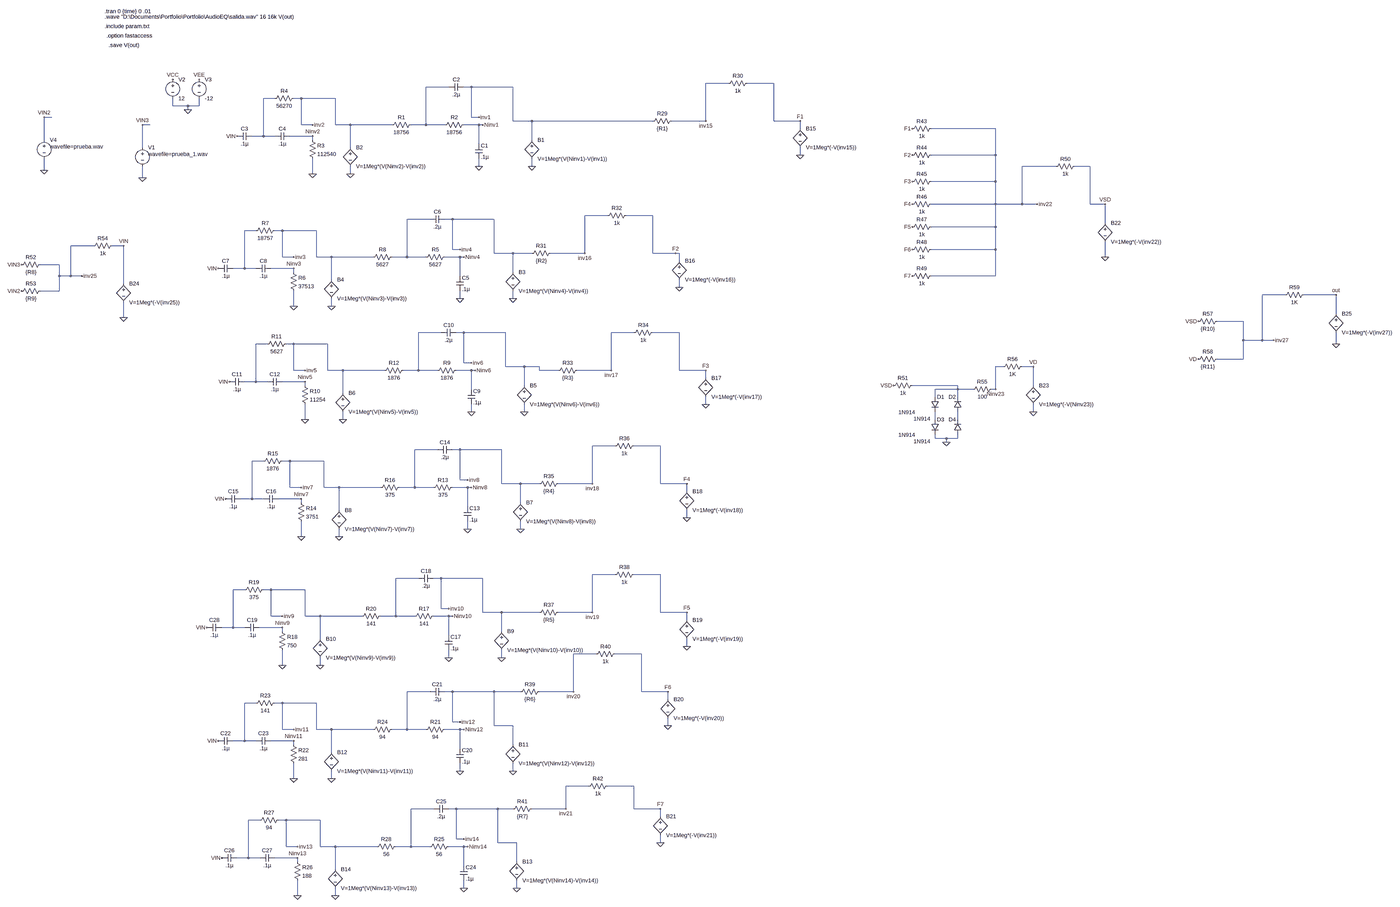
[diagram p0: schematic Test.asc, whole sheet]
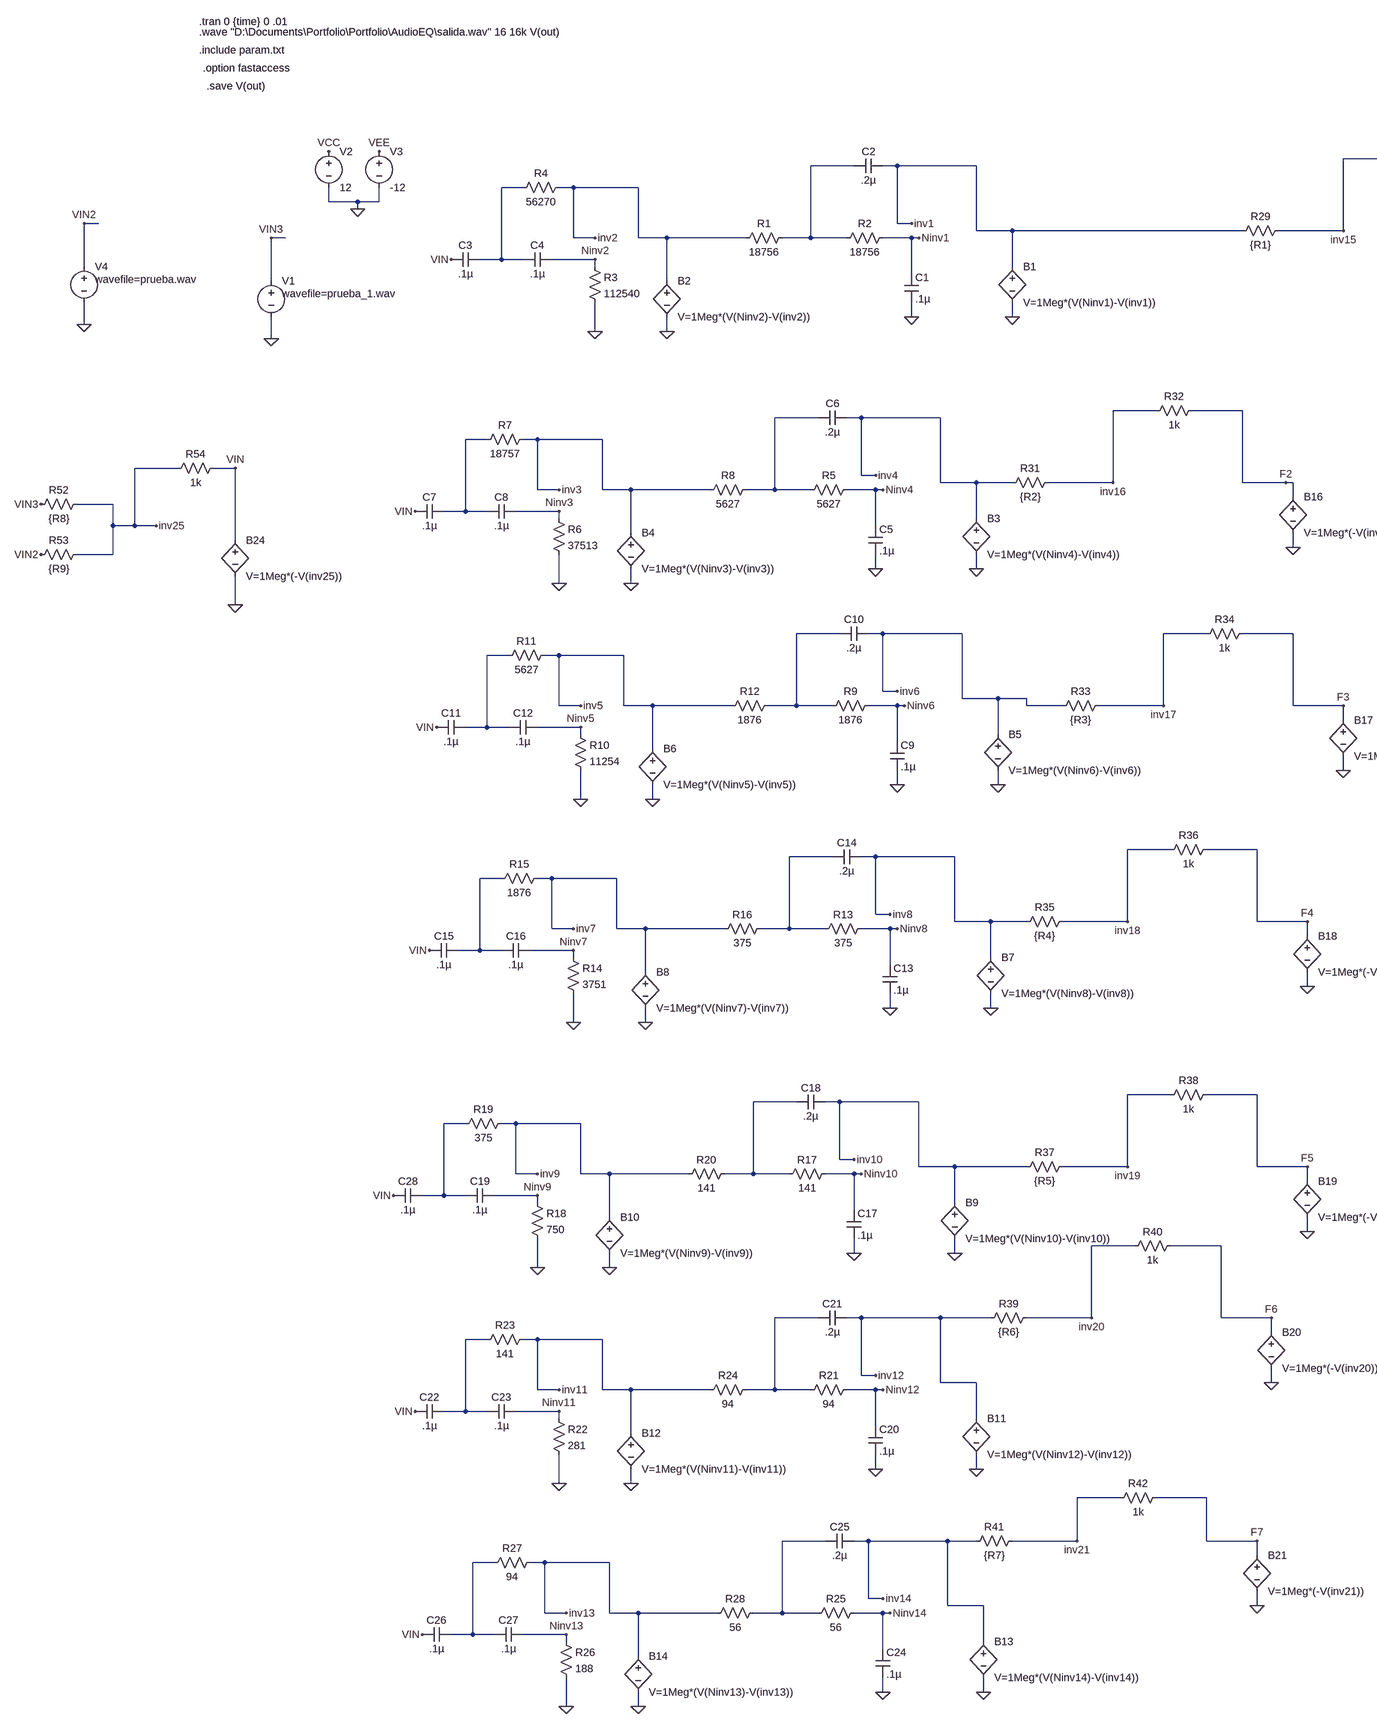
[diagram p1: schematic Test.asc, part, row 1 of 1, column 1 of 2]
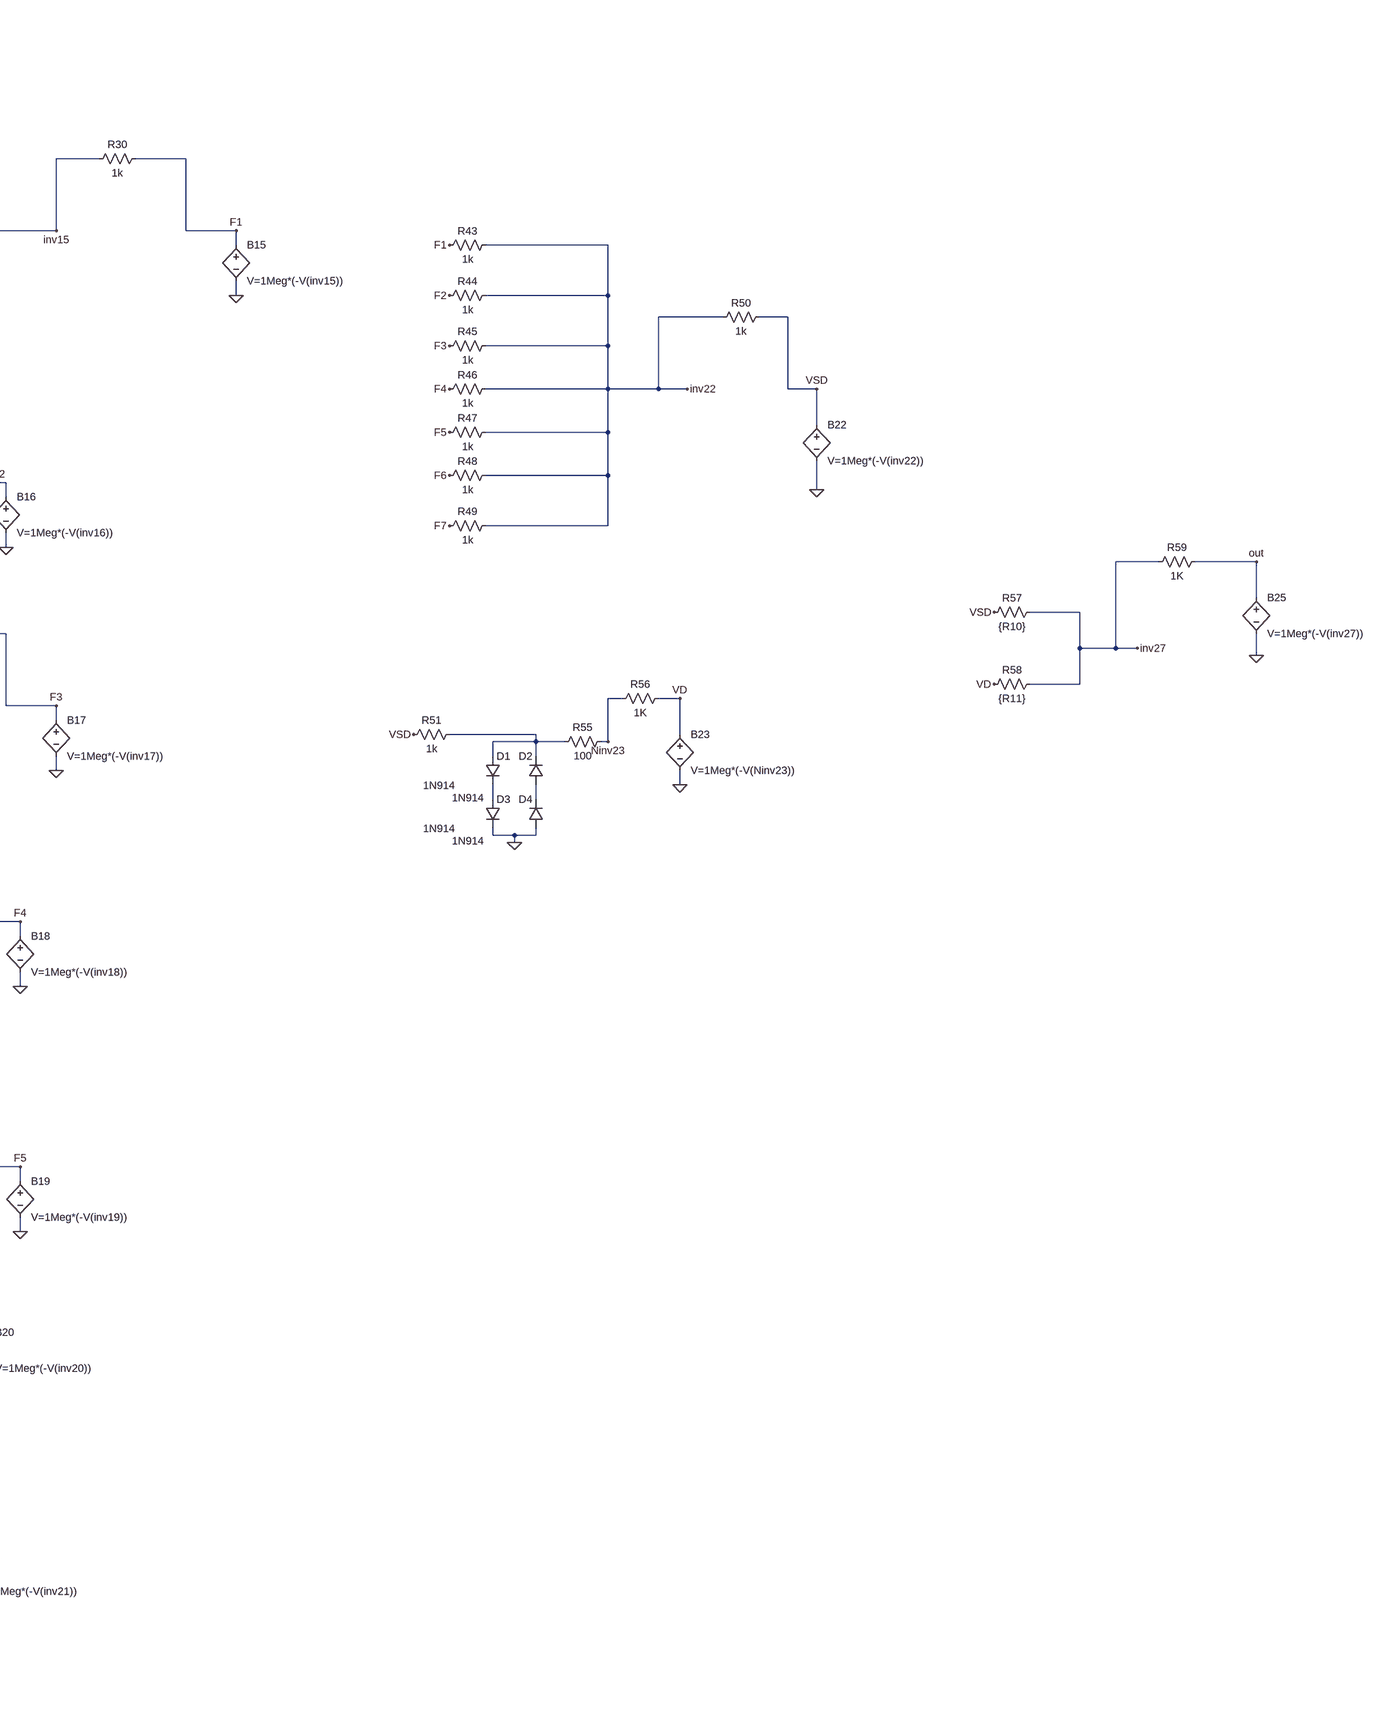
[diagram p2: schematic Test.asc, part, row 1 of 1, column 2 of 2]
Test.asc, the LTspice schematic file:
Version 4
SHEET 1 5436 3400
WIRE 2224 -96 2128 -96
WIRE 2416 -96 2304 -96
WIRE 1040 -80 944 -80
WIRE 1136 -80 1104 -80
WIRE 1312 -80 1136 -80
WIRE 304 -32 256 -32
WIRE 416 -32 384 -32
WIRE 560 -32 416 -32
WIRE -128 0 -128 -32
WIRE -64 0 -128 0
WIRE -16 0 -16 -32
WIRE -16 0 -64 0
WIRE -64 16 -64 0
WIRE -640 48 -672 48
WIRE 1136 48 1136 -80
WIRE 1168 48 1136 48
WIRE 1312 64 1312 -80
WIRE 1392 64 1312 64
WIRE 1904 64 1392 64
WIRE 2128 64 2128 -96
WIRE 2128 64 1984 64
WIRE 2416 64 2416 -96
WIRE 2528 64 2416 64
WIRE -224 80 -256 80
WIRE 416 80 416 -32
WIRE 464 80 416 80
WIRE 560 80 560 -32
WIRE 624 80 560 80
WIRE 800 80 624 80
WIRE 944 80 944 -80
WIRE 944 80 880 80
WIRE 1024 80 944 80
WIRE 1168 80 1104 80
WIRE 1184 80 1168 80
WIRE 2528 96 2528 64
WIRE 3488 96 3216 96
WIRE 256 128 256 -32
WIRE 256 128 208 128
WIRE 304 128 256 128
WIRE 464 128 368 128
WIRE -672 144 -672 48
WIRE 464 144 464 128
WIRE 1392 144 1392 64
WIRE 1168 160 1168 80
WIRE -256 176 -256 80
WIRE 624 176 624 80
WIRE 2528 208 2528 176
WIRE 3488 208 3488 96
WIRE 3488 208 3216 208
WIRE 1168 256 1168 224
WIRE 1392 256 1392 224
WIRE 3744 256 3600 256
WIRE 3888 256 3824 256
WIRE -672 272 -672 224
WIRE 464 288 464 224
WIRE 624 288 624 256
WIRE -256 304 -256 256
WIRE 3488 320 3488 208
WIRE 3488 320 3216 320
WIRE 3488 416 3488 320
WIRE 3488 416 3216 416
WIRE 3600 416 3600 256
WIRE 3600 416 3488 416
WIRE 3664 416 3600 416
WIRE 3888 416 3888 256
WIRE 3952 416 3888 416
WIRE 1712 464 1616 464
WIRE 1904 464 1792 464
WIRE 960 480 864 480
WIRE 1056 480 1024 480
WIRE 1232 480 1056 480
WIRE 3952 496 3952 416
WIRE 3488 512 3488 416
WIRE 3488 512 3216 512
WIRE 224 528 176 528
WIRE 336 528 304 528
WIRE 480 528 336 528
WIRE -464 592 -560 592
WIRE -336 592 -384 592
WIRE 1056 608 1056 480
WIRE 1088 608 1056 608
WIRE 3488 608 3488 512
WIRE 3488 608 3216 608
WIRE 1232 624 1232 480
WIRE 1312 624 1232 624
WIRE 1392 624 1312 624
WIRE 1616 624 1616 464
WIRE 1616 624 1472 624
WIRE 1904 624 1904 464
WIRE 2000 624 1904 624
WIRE 2016 624 2000 624
WIRE 336 640 336 528
WIRE 384 640 336 640
WIRE 480 640 480 528
WIRE 544 640 480 640
WIRE 720 640 544 640
WIRE 864 640 864 480
WIRE 864 640 800 640
WIRE 944 640 864 640
WIRE 1088 640 1024 640
WIRE 1104 640 1088 640
WIRE 3952 640 3952 576
WIRE 2016 656 2016 624
WIRE -608 672 -688 672
WIRE 176 688 176 528
WIRE 176 688 128 688
WIRE 224 688 176 688
WIRE 384 688 288 688
WIRE 384 704 384 688
WIRE 1312 704 1312 624
WIRE -608 720 -608 672
WIRE -560 720 -560 592
WIRE -560 720 -608 720
WIRE -512 720 -560 720
WIRE 1088 720 1088 640
WIRE 3488 720 3488 608
WIRE 3488 720 3216 720
WIRE 544 736 544 640
WIRE -336 752 -336 592
WIRE 2016 768 2016 736
WIRE -608 784 -608 720
WIRE -608 784 -688 784
WIRE 4928 800 4832 800
WIRE 5168 800 5008 800
WIRE 1088 816 1088 784
WIRE 1312 816 1312 784
WIRE 384 848 384 784
WIRE 544 848 544 816
WIRE 5168 880 5168 800
WIRE -336 896 -336 832
WIRE 4752 912 4608 912
WIRE 1008 960 912 960
WIRE 1104 960 1072 960
WIRE 1280 960 1104 960
WIRE 1824 960 1728 960
WIRE 2016 960 1904 960
WIRE 4752 992 4752 912
WIRE 4832 992 4832 800
WIRE 4832 992 4752 992
WIRE 4880 992 4832 992
WIRE 272 1008 224 1008
WIRE 384 1008 352 1008
WIRE 528 1008 384 1008
WIRE 5168 1008 5168 960
WIRE 4752 1072 4752 992
WIRE 4752 1072 4608 1072
WIRE 1104 1088 1104 960
WIRE 1136 1088 1104 1088
WIRE 1280 1104 1280 960
WIRE 1360 1104 1280 1104
WIRE 1424 1104 1360 1104
WIRE 3520 1104 3488 1104
WIRE 3648 1104 3600 1104
WIRE 384 1120 384 1008
WIRE 432 1120 384 1120
WIRE 528 1120 528 1008
WIRE 592 1120 528 1120
WIRE 768 1120 592 1120
WIRE 912 1120 912 960
WIRE 912 1120 848 1120
WIRE 992 1120 912 1120
WIRE 1136 1120 1072 1120
WIRE 1152 1120 1136 1120
WIRE 1424 1120 1424 1104
WIRE 1504 1120 1424 1120
WIRE 1728 1120 1728 960
WIRE 1728 1120 1584 1120
WIRE 2016 1120 2016 960
WIRE 2128 1120 2016 1120
WIRE 2128 1152 2128 1120
WIRE 224 1168 224 1008
WIRE 224 1168 176 1168
WIRE 272 1168 224 1168
WIRE 432 1168 336 1168
WIRE 432 1184 432 1168
WIRE 1360 1184 1360 1104
WIRE 3328 1184 3136 1184
WIRE 3648 1184 3648 1104
WIRE 1136 1200 1136 1120
WIRE 3328 1200 3328 1184
WIRE 3328 1200 3232 1200
WIRE 3392 1200 3328 1200
WIRE 3488 1200 3488 1104
WIRE 3488 1200 3472 1200
WIRE 592 1216 592 1120
WIRE 3232 1232 3232 1200
WIRE 3328 1232 3328 1200
WIRE 2128 1264 2128 1232
WIRE 1136 1296 1136 1264
WIRE 1360 1296 1360 1264
WIRE 3648 1296 3648 1264
WIRE 432 1328 432 1264
WIRE 592 1328 592 1296
WIRE 3232 1328 3232 1296
WIRE 3328 1328 3328 1296
WIRE 3232 1408 3232 1392
WIRE 3280 1408 3232 1408
WIRE 3328 1408 3328 1392
WIRE 3328 1408 3280 1408
WIRE 3280 1424 3280 1408
WIRE 1744 1440 1648 1440
WIRE 1936 1440 1824 1440
WIRE 992 1456 896 1456
WIRE 1088 1456 1056 1456
WIRE 1264 1456 1088 1456
WIRE 256 1504 208 1504
WIRE 368 1504 336 1504
WIRE 512 1504 368 1504
WIRE 1088 1584 1088 1456
WIRE 1120 1584 1088 1584
WIRE 1264 1600 1264 1456
WIRE 1344 1600 1264 1600
WIRE 1424 1600 1344 1600
WIRE 1648 1600 1648 1440
WIRE 1648 1600 1504 1600
WIRE 1936 1600 1936 1440
WIRE 2048 1600 1936 1600
WIRE 368 1616 368 1504
WIRE 416 1616 368 1616
WIRE 512 1616 512 1504
WIRE 576 1616 512 1616
WIRE 752 1616 576 1616
WIRE 896 1616 896 1456
WIRE 896 1616 832 1616
WIRE 976 1616 896 1616
WIRE 1120 1616 1056 1616
WIRE 1136 1616 1120 1616
WIRE 2048 1632 2048 1600
WIRE 208 1664 208 1504
WIRE 208 1664 160 1664
WIRE 256 1664 208 1664
WIRE 416 1664 320 1664
WIRE 416 1680 416 1664
WIRE 1344 1680 1344 1600
WIRE 1120 1696 1120 1616
WIRE 576 1712 576 1616
WIRE 2048 1744 2048 1712
WIRE 1120 1792 1120 1760
WIRE 1344 1792 1344 1760
WIRE 416 1824 416 1760
WIRE 576 1824 576 1792
WIRE 1744 2000 1648 2000
WIRE 1936 2000 1824 2000
WIRE 912 2016 816 2016
WIRE 1008 2016 976 2016
WIRE 1184 2016 1008 2016
WIRE 176 2064 128 2064
WIRE 288 2064 256 2064
WIRE 432 2064 288 2064
WIRE 1008 2144 1008 2016
WIRE 1040 2144 1008 2144
WIRE 1184 2160 1184 2016
WIRE 1264 2160 1184 2160
WIRE 1424 2160 1264 2160
WIRE 1648 2160 1648 2000
WIRE 1648 2160 1504 2160
WIRE 1936 2160 1936 2000
WIRE 2048 2160 1936 2160
WIRE 288 2176 288 2064
WIRE 336 2176 288 2176
WIRE 432 2176 432 2064
WIRE 496 2176 432 2176
WIRE 672 2176 496 2176
WIRE 816 2176 816 2016
WIRE 816 2176 752 2176
WIRE 896 2176 816 2176
WIRE 1040 2176 976 2176
WIRE 1056 2176 1040 2176
WIRE 2048 2192 2048 2160
WIRE 128 2224 128 2064
WIRE 128 2224 80 2224
WIRE 176 2224 128 2224
WIRE 336 2224 240 2224
WIRE 336 2240 336 2224
WIRE 1264 2240 1264 2160
WIRE 1040 2256 1040 2176
WIRE 496 2272 496 2176
WIRE 2048 2304 2048 2272
WIRE 1664 2336 1568 2336
WIRE 1856 2336 1744 2336
WIRE 1040 2352 1040 2320
WIRE 1264 2352 1264 2320
WIRE 336 2384 336 2320
WIRE 496 2384 496 2352
WIRE 960 2496 864 2496
WIRE 1056 2496 1024 2496
WIRE 1232 2496 1056 2496
WIRE 1344 2496 1232 2496
WIRE 1568 2496 1568 2336
WIRE 1568 2496 1424 2496
WIRE 1856 2496 1856 2336
WIRE 1968 2496 1856 2496
WIRE 1968 2528 1968 2496
WIRE 224 2544 176 2544
WIRE 336 2544 304 2544
WIRE 480 2544 336 2544
WIRE 1056 2624 1056 2496
WIRE 1088 2624 1056 2624
WIRE 1232 2640 1232 2496
WIRE 1312 2640 1232 2640
WIRE 1968 2640 1968 2608
WIRE 336 2656 336 2544
WIRE 384 2656 336 2656
WIRE 480 2656 480 2544
WIRE 544 2656 480 2656
WIRE 720 2656 544 2656
WIRE 864 2656 864 2496
WIRE 864 2656 800 2656
WIRE 944 2656 864 2656
WIRE 1088 2656 1024 2656
WIRE 1104 2656 1088 2656
WIRE 176 2704 176 2544
WIRE 176 2704 128 2704
WIRE 224 2704 176 2704
WIRE 384 2704 288 2704
WIRE 384 2720 384 2704
WIRE 1312 2720 1312 2640
WIRE 1088 2736 1088 2656
WIRE 544 2752 544 2656
WIRE 1088 2832 1088 2800
WIRE 1312 2832 1312 2800
WIRE 384 2864 384 2800
WIRE 544 2864 544 2832
WIRE 1632 2896 1536 2896
WIRE 1824 2896 1712 2896
WIRE 976 2992 880 2992
WIRE 1072 2992 1040 2992
WIRE 1248 2992 1072 2992
WIRE 1312 2992 1248 2992
WIRE 1536 2992 1536 2896
WIRE 1536 2992 1392 2992
WIRE 1824 2992 1824 2896
WIRE 1936 2992 1824 2992
WIRE 1936 3024 1936 2992
WIRE 240 3040 192 3040
WIRE 352 3040 320 3040
WIRE 496 3040 352 3040
WIRE 1072 3120 1072 2992
WIRE 1104 3120 1072 3120
WIRE 1248 3136 1248 2992
WIRE 1328 3136 1248 3136
WIRE 1936 3136 1936 3104
WIRE 352 3152 352 3040
WIRE 400 3152 352 3152
WIRE 496 3152 496 3040
WIRE 560 3152 496 3152
WIRE 736 3152 560 3152
WIRE 880 3152 880 2992
WIRE 880 3152 816 3152
WIRE 960 3152 880 3152
WIRE 1104 3152 1040 3152
WIRE 1120 3152 1104 3152
WIRE 192 3200 192 3040
WIRE 192 3200 144 3200
WIRE 240 3200 192 3200
WIRE 400 3200 304 3200
WIRE 400 3216 400 3200
WIRE 1328 3216 1328 3136
WIRE 1104 3232 1104 3152
WIRE 560 3248 560 3152
WIRE 1104 3328 1104 3296
WIRE 1328 3328 1328 3296
WIRE 400 3360 400 3296
WIRE 560 3360 560 3328
FLAG -256 304 0
FLAG 1168 256 0
FLAG -64 16 0
FLAG -128 -112 VCC
FLAG -16 -112 VEE
FLAG 1168 48 inv1
FLAG 1184 80 Ninv1
FLAG 1392 256 0
FLAG 464 288 0
FLAG 464 80 inv2
FLAG 464 128 Ninv2
FLAG 624 288 0
FLAG -256 80 VIN3
FLAG 144 128 VIN
FLAG 1088 816 0
FLAG 1088 608 inv4
FLAG 1104 640 Ninv4
FLAG 1312 816 0
FLAG 384 848 0
FLAG 384 640 inv3
FLAG 384 688 Ninv3
FLAG 544 848 0
FLAG 64 688 VIN
FLAG 1136 1296 0
FLAG 1136 1088 inv6
FLAG 1152 1120 Ninv6
FLAG 1360 1296 0
FLAG 432 1328 0
FLAG 432 1120 inv5
FLAG 432 1168 Ninv5
FLAG 592 1328 0
FLAG 112 1168 VIN
FLAG 1120 1792 0
FLAG 1120 1584 inv8
FLAG 1136 1616 Ninv8
FLAG 1344 1792 0
FLAG 416 1824 0
FLAG 416 1616 inv7
FLAG 416 1664 Ninv7
FLAG 576 1824 0
FLAG 96 1664 VIN
FLAG 1040 2352 0
FLAG 1040 2144 inv10
FLAG 1056 2176 Ninv10
FLAG 1264 2352 0
FLAG 336 2384 0
FLAG 336 2176 inv9
FLAG 336 2224 Ninv9
FLAG 496 2384 0
FLAG 1088 2832 0
FLAG 1088 2624 inv12
FLAG 1104 2656 Ninv12
FLAG 1312 2832 0
FLAG 384 2864 0
FLAG 384 2656 inv11
FLAG 384 2704 Ninv11
FLAG 544 2864 0
FLAG 64 2704 VIN
FLAG 1104 3328 0
FLAG 1104 3120 inv14
FLAG 1120 3152 Ninv14
FLAG 1328 3328 0
FLAG 400 3360 0
FLAG 400 3152 inv13
FLAG 400 3200 Ninv13
FLAG 560 3360 0
FLAG 80 3200 VIN
FLAG 16 2224 VIN
FLAG 2528 208 0
FLAG 2128 64 inv15
FLAG 2016 768 0
FLAG 1616 624 inv16
FLAG 2128 1264 0
FLAG 1728 1120 inv17
FLAG 2048 1744 0
FLAG 1648 1600 inv18
FLAG 2048 2304 0
FLAG 1648 2160 inv19
FLAG 1968 2640 0
FLAG 1568 2496 inv20
FLAG 1936 3136 0
FLAG 1536 2992 inv21
FLAG 2528 64 F1
FLAG 2000 624 F2
FLAG 2128 1120 F3
FLAG 2048 1600 F4
FLAG 2048 2160 F5
FLAG 1968 2496 F6
FLAG 1936 2992 F7
FLAG 3136 96 F1
FLAG 3136 208 F2
FLAG 3136 320 F3
FLAG 3136 416 F4
FLAG 3136 512 F5
FLAG 3136 608 F6
FLAG 3136 720 F7
FLAG 3664 416 inv22
FLAG 3952 640 0
FLAG 3648 1296 0
FLAG 3280 1424 0
FLAG -672 272 0
FLAG -672 48 VIN2
FLAG -336 896 0
FLAG -336 592 VIN
FLAG -512 720 inv25
FLAG -768 784 VIN2
FLAG -768 672 VIN3
FLAG 3952 416 VSD
FLAG 3488 1200 Ninv23
FLAG 3056 1184 VSD
FLAG 3648 1104 VD
FLAG 4528 1072 VD
FLAG 4528 912 VSD
FLAG 5168 1008 0
FLAG 4880 992 inv27
FLAG 5168 800 out
SYMBOL voltage -256 160 R0
WINDOW 3 24 44 Left 2
SYMATTR Value wavefile=prueba_1.wav
SYMATTR InstName V1
SYMBOL res 1120 64 R90
WINDOW 0 0 56 VBottom 2
WINDOW 3 32 56 VTop 2
SYMATTR InstName R2
SYMATTR Value 18756
SYMBOL cap 1152 160 R0
SYMATTR InstName C1
SYMATTR Value .1µ
SYMBOL cap 1104 -96 R90
WINDOW 0 0 32 VBottom 2
WINDOW 3 32 32 VTop 2
SYMATTR InstName C2
SYMATTR Value .2µ
SYMBOL voltage -128 -128 R0
WINDOW 123 0 0 Left 0
WINDOW 39 0 0 Left 0
SYMATTR InstName V2
SYMATTR Value 12
SYMBOL voltage -16 -128 R0
WINDOW 123 0 0 Left 0
WINDOW 39 0 0 Left 0
SYMATTR InstName V3
SYMATTR Value -12
SYMBOL bv 1392 128 R0
SYMATTR InstName B1
SYMATTR Value V=1Meg*(V(Ninv1)-V(inv1))
SYMBOL cap 208 112 R90
WINDOW 0 0 32 VBottom 2
WINDOW 3 32 32 VTop 2
SYMATTR InstName C3
SYMATTR Value .1µ
SYMBOL cap 368 112 R90
WINDOW 0 0 32 VBottom 2
WINDOW 3 32 32 VTop 2
SYMATTR InstName C4
SYMATTR Value .1µ
SYMBOL res 448 128 R0
SYMATTR InstName R3
SYMATTR Value 112540
SYMBOL res 400 -48 R90
WINDOW 0 0 56 VBottom 2
WINDOW 3 32 56 VTop 2
SYMATTR InstName R4
SYMATTR Value 56270
SYMBOL bv 624 160 R0
SYMATTR InstName B2
SYMATTR Value V=1Meg*(V(Ninv2)-V(inv2))
SYMBOL res 896 64 R90
WINDOW 0 0 56 VBottom 2
WINDOW 3 32 56 VTop 2
SYMATTR InstName R1
SYMATTR Value 18756
SYMBOL res 1040 624 R90
WINDOW 0 0 56 VBottom 2
WINDOW 3 32 56 VTop 2
SYMATTR InstName R5
SYMATTR Value 5627
SYMBOL cap 1072 720 R0
SYMATTR InstName C5
SYMATTR Value .1µ
SYMBOL cap 1024 464 R90
WINDOW 0 0 32 VBottom 2
WINDOW 3 32 32 VTop 2
SYMATTR InstName C6
SYMATTR Value .2µ
SYMBOL bv 1312 688 R0
SYMATTR InstName B3
SYMATTR Value V=1Meg*(V(Ninv4)-V(inv4))
SYMBOL cap 128 672 R90
WINDOW 0 0 32 VBottom 2
WINDOW 3 32 32 VTop 2
SYMATTR InstName C7
SYMATTR Value .1µ
SYMBOL cap 288 672 R90
WINDOW 0 0 32 VBottom 2
WINDOW 3 32 32 VTop 2
SYMATTR InstName C8
SYMATTR Value .1µ
SYMBOL res 368 688 R0
SYMATTR InstName R6
SYMATTR Value 37513
SYMBOL res 320 512 R90
WINDOW 0 0 56 VBottom 2
WINDOW 3 32 56 VTop 2
SYMATTR InstName R7
SYMATTR Value 18757
SYMBOL bv 544 720 R0
SYMATTR InstName B4
SYMATTR Value V=1Meg*(V(Ninv3)-V(inv3))
SYMBOL res 816 624 R90
WINDOW 0 0 56 VBottom 2
WINDOW 3 32 56 VTop 2
SYMATTR InstName R8
SYMATTR Value 5627
SYMBOL res 1088 1104 R90
WINDOW 0 0 56 VBottom 2
WINDOW 3 32 56 VTop 2
SYMATTR InstName R9
SYMATTR Value 1876
SYMBOL cap 1120 1200 R0
SYMATTR InstName C9
SYMATTR Value .1µ
SYMBOL cap 1072 944 R90
WINDOW 0 0 32 VBottom 2
WINDOW 3 32 32 VTop 2
SYMATTR InstName C10
SYMATTR Value .2µ
SYMBOL bv 1360 1168 R0
SYMATTR InstName B5
SYMATTR Value V=1Meg*(V(Ninv6)-V(inv6))
SYMBOL cap 176 1152 R90
WINDOW 0 0 32 VBottom 2
WINDOW 3 32 32 VTop 2
SYMATTR InstName C11
SYMATTR Value .1µ
SYMBOL cap 336 1152 R90
WINDOW 0 0 32 VBottom 2
WINDOW 3 32 32 VTop 2
SYMATTR InstName C12
SYMATTR Value .1µ
SYMBOL res 416 1168 R0
SYMATTR InstName R10
SYMATTR Value 11254
SYMBOL res 368 992 R90
WINDOW 0 0 56 VBottom 2
WINDOW 3 32 56 VTop 2
SYMATTR InstName R11
SYMATTR Value 5627
SYMBOL bv 592 1200 R0
SYMATTR InstName B6
SYMATTR Value V=1Meg*(V(Ninv5)-V(inv5))
SYMBOL res 864 1104 R90
WINDOW 0 0 56 VBottom 2
WINDOW 3 32 56 VTop 2
SYMATTR InstName R12
SYMATTR Value 1876
SYMBOL res 1072 1600 R90
WINDOW 0 0 56 VBottom 2
WINDOW 3 32 56 VTop 2
SYMATTR InstName R13
SYMATTR Value 375
SYMBOL cap 1104 1696 R0
SYMATTR InstName C13
SYMATTR Value .1µ
SYMBOL cap 1056 1440 R90
WINDOW 0 0 32 VBottom 2
WINDOW 3 32 32 VTop 2
SYMATTR InstName C14
SYMATTR Value .2µ
SYMBOL bv 1344 1664 R0
SYMATTR InstName B7
SYMATTR Value V=1Meg*(V(Ninv8)-V(inv8))
SYMBOL cap 160 1648 R90
WINDOW 0 0 32 VBottom 2
WINDOW 3 32 32 VTop 2
SYMATTR InstName C15
SYMATTR Value .1µ
SYMBOL cap 320 1648 R90
WINDOW 0 0 32 VBottom 2
WINDOW 3 32 32 VTop 2
SYMATTR InstName C16
SYMATTR Value .1µ
SYMBOL res 400 1664 R0
SYMATTR InstName R14
SYMATTR Value 3751
SYMBOL res 352 1488 R90
WINDOW 0 0 56 VBottom 2
WINDOW 3 32 56 VTop 2
SYMATTR InstName R15
SYMATTR Value 1876
SYMBOL bv 576 1696 R0
SYMATTR InstName B8
SYMATTR Value V=1Meg*(V(Ninv7)-V(inv7))
SYMBOL res 848 1600 R90
WINDOW 0 0 56 VBottom 2
WINDOW 3 32 56 VTop 2
SYMATTR InstName R16
SYMATTR Value 375
SYMBOL res 992 2160 R90
WINDOW 0 0 56 VBottom 2
WINDOW 3 32 56 VTop 2
SYMATTR InstName R17
SYMATTR Value 141
SYMBOL cap 1024 2256 R0
SYMATTR InstName C17
SYMATTR Value .1µ
SYMBOL cap 976 2000 R90
WINDOW 0 0 32 VBottom 2
WINDOW 3 32 32 VTop 2
SYMATTR InstName C18
SYMATTR Value .2µ
SYMBOL bv 1264 2224 R0
SYMATTR InstName B9
SYMATTR Value V=1Meg*(V(Ninv10)-V(inv10))
SYMBOL cap 240 2208 R90
WINDOW 0 0 32 VBottom 2
WINDOW 3 32 32 VTop 2
SYMATTR InstName C19
SYMATTR Value .1µ
SYMBOL res 320 2224 R0
SYMATTR InstName R18
SYMATTR Value 750
SYMBOL res 272 2048 R90
WINDOW 0 0 56 VBottom 2
WINDOW 3 32 56 VTop 2
SYMATTR InstName R19
SYMATTR Value 375
SYMBOL bv 496 2256 R0
SYMATTR InstName B10
SYMATTR Value V=1Meg*(V(Ninv9)-V(inv9))
SYMBOL res 768 2160 R90
WINDOW 0 0 56 VBottom 2
WINDOW 3 32 56 VTop 2
SYMATTR InstName R20
SYMATTR Value 141
SYMBOL res 1040 2640 R90
WINDOW 0 0 56 VBottom 2
WINDOW 3 32 56 VTop 2
SYMATTR InstName R21
SYMATTR Value 94
SYMBOL cap 1072 2736 R0
SYMATTR InstName C20
SYMATTR Value .1µ
SYMBOL cap 1024 2480 R90
WINDOW 0 0 32 VBottom 2
WINDOW 3 32 32 VTop 2
SYMATTR InstName C21
SYMATTR Value .2µ
SYMBOL bv 1312 2704 R0
SYMATTR InstName B11
SYMATTR Value V=1Meg*(V(Ninv12)-V(inv12))
SYMBOL cap 128 2688 R90
WINDOW 0 0 32 VBottom 2
WINDOW 3 32 32 VTop 2
SYMATTR InstName C22
SYMATTR Value .1µ
SYMBOL cap 288 2688 R90
WINDOW 0 0 32 VBottom 2
WINDOW 3 32 32 VTop 2
SYMATTR InstName C23
SYMATTR Value .1µ
SYMBOL res 368 2704 R0
SYMATTR InstName R22
SYMATTR Value 281
SYMBOL res 320 2528 R90
WINDOW 0 0 56 VBottom 2
WINDOW 3 32 56 VTop 2
SYMATTR InstName R23
SYMATTR Value 141
SYMBOL bv 544 2736 R0
SYMATTR InstName B12
SYMATTR Value V=1Meg*(V(Ninv11)-V(inv11))
SYMBOL res 816 2640 R90
WINDOW 0 0 56 VBottom 2
WINDOW 3 32 56 VTop 2
SYMATTR InstName R24
SYMATTR Value 94
SYMBOL res 1056 3136 R90
WINDOW 0 0 56 VBottom 2
WINDOW 3 32 56 VTop 2
SYMATTR InstName R25
SYMATTR Value 56
SYMBOL cap 1088 3232 R0
SYMATTR InstName C24
SYMATTR Value .1µ
SYMBOL cap 1040 2976 R90
WINDOW 0 0 32 VBottom 2
WINDOW 3 32 32 VTop 2
SYMATTR InstName C25
SYMATTR Value .2µ
SYMBOL bv 1328 3200 R0
SYMATTR InstName B13
SYMATTR Value V=1Meg*(V(Ninv14)-V(inv14))
SYMBOL cap 144 3184 R90
WINDOW 0 0 32 VBottom 2
WINDOW 3 32 32 VTop 2
SYMATTR InstName C26
SYMATTR Value .1µ
SYMBOL cap 304 3184 R90
WINDOW 0 0 32 VBottom 2
WINDOW 3 32 32 VTop 2
SYMATTR InstName C27
SYMATTR Value .1µ
SYMBOL res 384 3200 R0
SYMATTR InstName R26
SYMATTR Value 188
SYMBOL res 336 3024 R90
WINDOW 0 0 56 VBottom 2
WINDOW 3 32 56 VTop 2
SYMATTR InstName R27
SYMATTR Value 94
SYMBOL bv 560 3232 R0
SYMATTR InstName B14
SYMATTR Value V=1Meg*(V(Ninv13)-V(inv13))
SYMBOL res 832 3136 R90
WINDOW 0 0 56 VBottom 2
WINDOW 3 32 56 VTop 2
SYMATTR InstName R28
SYMATTR Value 56
SYMBOL cap 80 2208 R90
WINDOW 0 0 32 VBottom 2
WINDOW 3 32 32 VTop 2
SYMATTR InstName C28
SYMATTR Value .1µ
SYMBOL res 2000 48 R90
WINDOW 0 0 56 VBottom 2
WINDOW 3 32 56 VTop 2
SYMATTR InstName R29
SYMATTR Value {R1}
SYMBOL res 2320 -112 R90
WINDOW 0 0 56 VBottom 2
WINDOW 3 32 56 VTop 2
SYMATTR InstName R30
SYMATTR Value 1k
SYMBOL bv 2528 80 R0
SYMATTR InstName B15
SYMATTR Value V=1Meg*(-V(inv15))
SYMBOL res 1488 608 R90
WINDOW 0 0 56 VBottom 2
WINDOW 3 32 56 VTop 2
SYMATTR InstName R31
SYMATTR Value {R2}
SYMBOL res 1808 448 R90
WINDOW 0 0 56 VBottom 2
WINDOW 3 32 56 VTop 2
SYMATTR InstName R32
SYMATTR Value 1k
SYMBOL bv 2016 640 R0
SYMATTR InstName B16
SYMATTR Value V=1Meg*(-V(inv16))
SYMBOL res 1600 1104 R90
WINDOW 0 0 56 VBottom 2
WINDOW 3 32 56 VTop 2
SYMATTR InstName R33
SYMATTR Value {R3}
SYMBOL res 1920 944 R90
WINDOW 0 0 56 VBottom 2
WINDOW 3 32 56 VTop 2
SYMATTR InstName R34
SYMATTR Value 1k
SYMBOL bv 2128 1136 R0
SYMATTR InstName B17
SYMATTR Value V=1Meg*(-V(inv17))
SYMBOL res 1520 1584 R90
WINDOW 0 0 56 VBottom 2
WINDOW 3 32 56 VTop 2
SYMATTR InstName R35
SYMATTR Value {R4}
SYMBOL res 1840 1424 R90
WINDOW 0 0 56 VBottom 2
WINDOW 3 32 56 VTop 2
SYMATTR InstName R36
SYMATTR Value 1k
SYMBOL bv 2048 1616 R0
SYMATTR InstName B18
SYMATTR Value V=1Meg*(-V(inv18))
SYMBOL res 1520 2144 R90
WINDOW 0 0 56 VBottom 2
WINDOW 3 32 56 VTop 2
SYMATTR InstName R37
SYMATTR Value {R5}
SYMBOL res 1840 1984 R90
WINDOW 0 0 56 VBottom 2
WINDOW 3 32 56 VTop 2
SYMATTR InstName R38
SYMATTR Value 1k
SYMBOL bv 2048 2176 R0
SYMATTR InstName B19
SYMATTR Value V=1Meg*(-V(inv19))
SYMBOL res 1440 2480 R90
WINDOW 0 0 56 VBottom 2
WINDOW 3 32 56 VTop 2
SYMATTR InstName R39
SYMATTR Value {R6}
SYMBOL res 1760 2320 R90
WINDOW 0 0 56 VBottom 2
WINDOW 3 32 56 VTop 2
SYMATTR InstName R40
SYMATTR Value 1k
SYMBOL bv 1968 2512 R0
SYMATTR InstName B20
SYMATTR Value V=1Meg*(-V(inv20))
SYMBOL res 1408 2976 R90
WINDOW 0 0 56 VBottom 2
WINDOW 3 32 56 VTop 2
SYMATTR InstName R41
SYMATTR Value {R7}
SYMBOL res 1728 2880 R90
WINDOW 0 0 56 VBottom 2
WINDOW 3 32 56 VTop 2
SYMATTR InstName R42
SYMATTR Value 1k
SYMBOL bv 1936 3008 R0
SYMATTR InstName B21
SYMATTR Value V=1Meg*(-V(inv21))
SYMBOL res 3232 80 R90
WINDOW 0 0 56 VBottom 2
WINDOW 3 32 56 VTop 2
SYMATTR InstName R43
SYMATTR Value 1k
SYMBOL res 3232 192 R90
WINDOW 0 0 56 VBottom 2
WINDOW 3 32 56 VTop 2
SYMATTR InstName R44
SYMATTR Value 1k
SYMBOL res 3232 304 R90
WINDOW 0 0 56 VBottom 2
WINDOW 3 32 56 VTop 2
SYMATTR InstName R45
SYMATTR Value 1k
SYMBOL res 3232 400 R90
WINDOW 0 0 56 VBottom 2
WINDOW 3 32 56 VTop 2
SYMATTR InstName R46
SYMATTR Value 1k
SYMBOL res 3232 496 R90
WINDOW 0 0 56 VBottom 2
WINDOW 3 32 56 VTop 2
SYMATTR InstName R47
SYMATTR Value 1k
SYMBOL res 3232 592 R90
WINDOW 0 0 56 VBottom 2
WINDOW 3 32 56 VTop 2
SYMATTR InstName R48
SYMATTR Value 1k
SYMBOL res 3232 704 R90
WINDOW 0 0 56 VBottom 2
WINDOW 3 32 56 VTop 2
SYMATTR InstName R49
SYMATTR Value 1k
SYMBOL res 3840 240 R90
WINDOW 0 0 56 VBottom 2
WINDOW 3 32 56 VTop 2
SYMATTR InstName R50
SYMATTR Value 1k
SYMBOL bv 3952 480 R0
SYMATTR InstName B22
SYMATTR Value V=1Meg*(-V(inv22))
SYMBOL res 3152 1168 R90
WINDOW 0 0 56 VBottom 2
WINDOW 3 32 56 VTop 2
SYMATTR InstName R51
SYMATTR Value 1k
SYMBOL diode 3216 1232 R0
WINDOW 3 -139 65 Left 2
SYMATTR Value 1N914
SYMATTR InstName D1
SYMBOL diode 3344 1296 R180
WINDOW 0 24 64 Left 2
WINDOW 3 132 -29 Left 2
SYMATTR InstName D2
SYMATTR Value 1N914
SYMBOL bv 3648 1168 R0
SYMATTR InstName B23
SYMATTR Value V=1Meg*(-V(Ninv23))
SYMBOL diode 3344 1392 R180
WINDOW 0 24 64 Left 2
WINDOW 3 132 -29 Left 2
SYMATTR InstName D4
SYMATTR Value 1N914
SYMBOL diode 3216 1328 R0
WINDOW 3 -139 65 Left 2
SYMATTR Value 1N914
SYMATTR InstName D3
SYMBOL voltage -672 128 R0
WINDOW 3 24 44 Left 2
SYMATTR Value wavefile=prueba.wav
SYMATTR InstName V4
SYMBOL res -672 656 R90
WINDOW 0 0 56 VBottom 2
WINDOW 3 32 56 VTop 2
SYMATTR InstName R52
SYMATTR Value {R8}
SYMBOL res -672 768 R90
WINDOW 0 0 56 VBottom 2
WINDOW 3 32 56 VTop 2
SYMATTR InstName R53
SYMATTR Value {R9}
SYMBOL res -368 576 R90
WINDOW 0 0 56 VBottom 2
WINDOW 3 32 56 VTop 2
SYMATTR InstName R54
SYMATTR Value 1k
SYMBOL bv -336 736 R0
SYMATTR InstName B24
SYMATTR Value V=1Meg*(-V(inv25))
SYMBOL res 3488 1184 R90
WINDOW 0 0 56 VBottom 2
WINDOW 3 32 56 VTop 2
SYMATTR InstName R55
SYMATTR Value 100
SYMBOL res 3616 1088 R90
WINDOW 0 0 56 VBottom 2
WINDOW 3 32 56 VTop 2
SYMATTR InstName R56
SYMATTR Value 1K
SYMBOL res 4624 896 R90
WINDOW 0 0 56 VBottom 2
WINDOW 3 32 56 VTop 2
SYMATTR InstName R57
SYMATTR Value {R10}
SYMBOL res 4624 1056 R90
WINDOW 0 0 56 VBottom 2
WINDOW 3 32 56 VTop 2
SYMATTR InstName R58
SYMATTR Value {R11}
SYMBOL res 5024 784 R90
WINDOW 0 0 56 VBottom 2
WINDOW 3 32 56 VTop 2
SYMATTR InstName R59
SYMATTR Value 1K
SYMBOL bv 5168 864 R0
SYMATTR InstName B25
SYMATTR Value V=1Meg*(-V(inv27))
TEXT -416 -448 Left 2 !.tran 0 {time} 0 .01
TEXT -416 -424 Left 2 !.wave "D:\\Documents\\Portfolio\\Portfolio\\AudioEQ\\salida.wav" 16 16k V(out)
TEXT -416 -384 Left 2 !.include param.txt
TEXT -408 -344 Left 2 !.option fastaccess
TEXT -400 -304 Left 2 !.save V(out)

The netlist it stands for:
* Test.asc
V1 VIN3 0 wavefile=prueba_1.wav
R2 Ninv1 N001 18756
C1 Ninv1 0 .1µ
C2 inv1 N001 .2µ
V2 VCC 0 12
V3 VEE 0 -12
B1 inv1 0 V=1Meg*(V(Ninv1)-V(inv1))
C3 N002 VIN .1µ
C4 Ninv2 N002 .1µ
R3 Ninv2 0 112540
R4 inv2 N002 56270
B2 inv2 0 V=1Meg*(V(Ninv2)-V(inv2))
R1 N001 inv2 18756
R5 Ninv4 N003 5627
C5 Ninv4 0 .1µ
C6 inv4 N003 .2µ
B3 inv4 0 V=1Meg*(V(Ninv4)-V(inv4))
C7 N004 VIN .1µ
C8 Ninv3 N004 .1µ
R6 Ninv3 0 37513
R7 inv3 N004 18757
B4 inv3 0 V=1Meg*(V(Ninv3)-V(inv3))
R8 N003 inv3 5627
R9 Ninv6 N005 1876
C9 Ninv6 0 .1µ
C10 inv6 N005 .2µ
B5 inv6 0 V=1Meg*(V(Ninv6)-V(inv6))
C11 N006 VIN .1µ
C12 Ninv5 N006 .1µ
R10 Ninv5 0 11254
R11 inv5 N006 5627
B6 inv5 0 V=1Meg*(V(Ninv5)-V(inv5))
R12 N005 inv5 1876
R13 Ninv8 N010 375
C13 Ninv8 0 .1µ
C14 inv8 N010 .2µ
B7 inv8 0 V=1Meg*(V(Ninv8)-V(inv8))
C15 N011 VIN .1µ
C16 Ninv7 N011 .1µ
R14 Ninv7 0 3751
R15 inv7 N011 1876
B8 inv7 0 V=1Meg*(V(Ninv7)-V(inv7))
R16 N010 inv7 375
R17 Ninv10 N012 141
C17 Ninv10 0 .1µ
C18 inv10 N012 .2µ
B9 inv10 0 V=1Meg*(V(Ninv10)-V(inv10))
C19 Ninv9 N013 .1µ
R18 Ninv9 0 750
R19 inv9 N013 375
B10 inv9 0 V=1Meg*(V(Ninv9)-V(inv9))
R20 N012 inv9 141
R21 Ninv12 N014 94
C20 Ninv12 0 .1µ
C21 inv12 N014 .2µ
B11 inv12 0 V=1Meg*(V(Ninv12)-V(inv12))
C22 N015 VIN .1µ
C23 Ninv11 N015 .1µ
R22 Ninv11 0 281
R23 inv11 N015 141
B12 inv11 0 V=1Meg*(V(Ninv11)-V(inv11))
R24 N014 inv11 94
R25 Ninv14 N016 56
C24 Ninv14 0 .1µ
C25 inv14 N016 .2µ
B13 inv14 0 V=1Meg*(V(Ninv14)-V(inv14))
C26 N017 VIN .1µ
C27 Ninv13 N017 .1µ
R26 Ninv13 0 188
R27 inv13 N017 94
B14 inv13 0 V=1Meg*(V(Ninv13)-V(inv13))
R28 N016 inv13 56
C28 N013 VIN .1µ
R29 inv15 inv1 {R1}
R30 F1 inv15 1k
B15 F1 0 V=1Meg*(-V(inv15))
R31 inv16 inv4 {R2}
R32 F2 inv16 1k
B16 F2 0 V=1Meg*(-V(inv16))
R33 inv17 inv6 {R3}
R34 F3 inv17 1k
B17 F3 0 V=1Meg*(-V(inv17))
R35 inv18 inv8 {R4}
R36 F4 inv18 1k
B18 F4 0 V=1Meg*(-V(inv18))
R37 inv19 inv10 {R5}
R38 F5 inv19 1k
B19 F5 0 V=1Meg*(-V(inv19))
R39 inv20 inv12 {R6}
R40 F6 inv20 1k
B20 F6 0 V=1Meg*(-V(inv20))
R41 inv21 inv14 {R7}
R42 F7 inv21 1k
B21 F7 0 V=1Meg*(-V(inv21))
R43 inv22 F1 1k
R44 inv22 F2 1k
R45 inv22 F3 1k
R46 inv22 F4 1k
R47 inv22 F5 1k
R48 inv22 F6 1k
R49 inv22 F7 1k
R50 VSD inv22 1k
B22 VSD 0 V=1Meg*(-V(inv22))
R51 N007 VSD 1k
D1 N007 N008 1N914
D2 N009 N007 1N914
B23 VD 0 V=1Meg*(-V(Ninv23))
D4 0 N009 1N914
D3 N008 0 1N914
V4 VIN2 0 wavefile=prueba.wav
R52 inv25 VIN3 {R8}
R53 inv25 VIN2 {R9}
R54 VIN inv25 1k
B24 VIN 0 V=1Meg*(-V(inv25))
R55 Ninv23 N007 100
R56 VD Ninv23 1K
R57 inv27 VSD {R10}
R58 inv27 VD {R11}
R59 out inv27 1K
B25 out 0 V=1Meg*(-V(inv27))
.model D D
.lib standard.dio
.tran 0 {time} 0 .01
.wave "D:\Documents\Portfolio\Portfolio\AudioEQ\salida.wav" 16 16k V(out)
.include param.txt
.option fastaccess
.save V(out)
.backanno
.end